# EasyEDA Pro project Remote323Board.eprj

# Schematic remote_3-2-3
Board Name: remote_3-2-3; Create Date: 2026-04-01; Page Name: remote_3-2-3; Project Name: Remote323Board; Schematic Name: remote_3-2-3; Update Date: 2026-03-31; Date: 4/1/2026; File: remote_3-2-3; Id: /; Rev: 1.0; Sheet: /; Title: Remote323Board
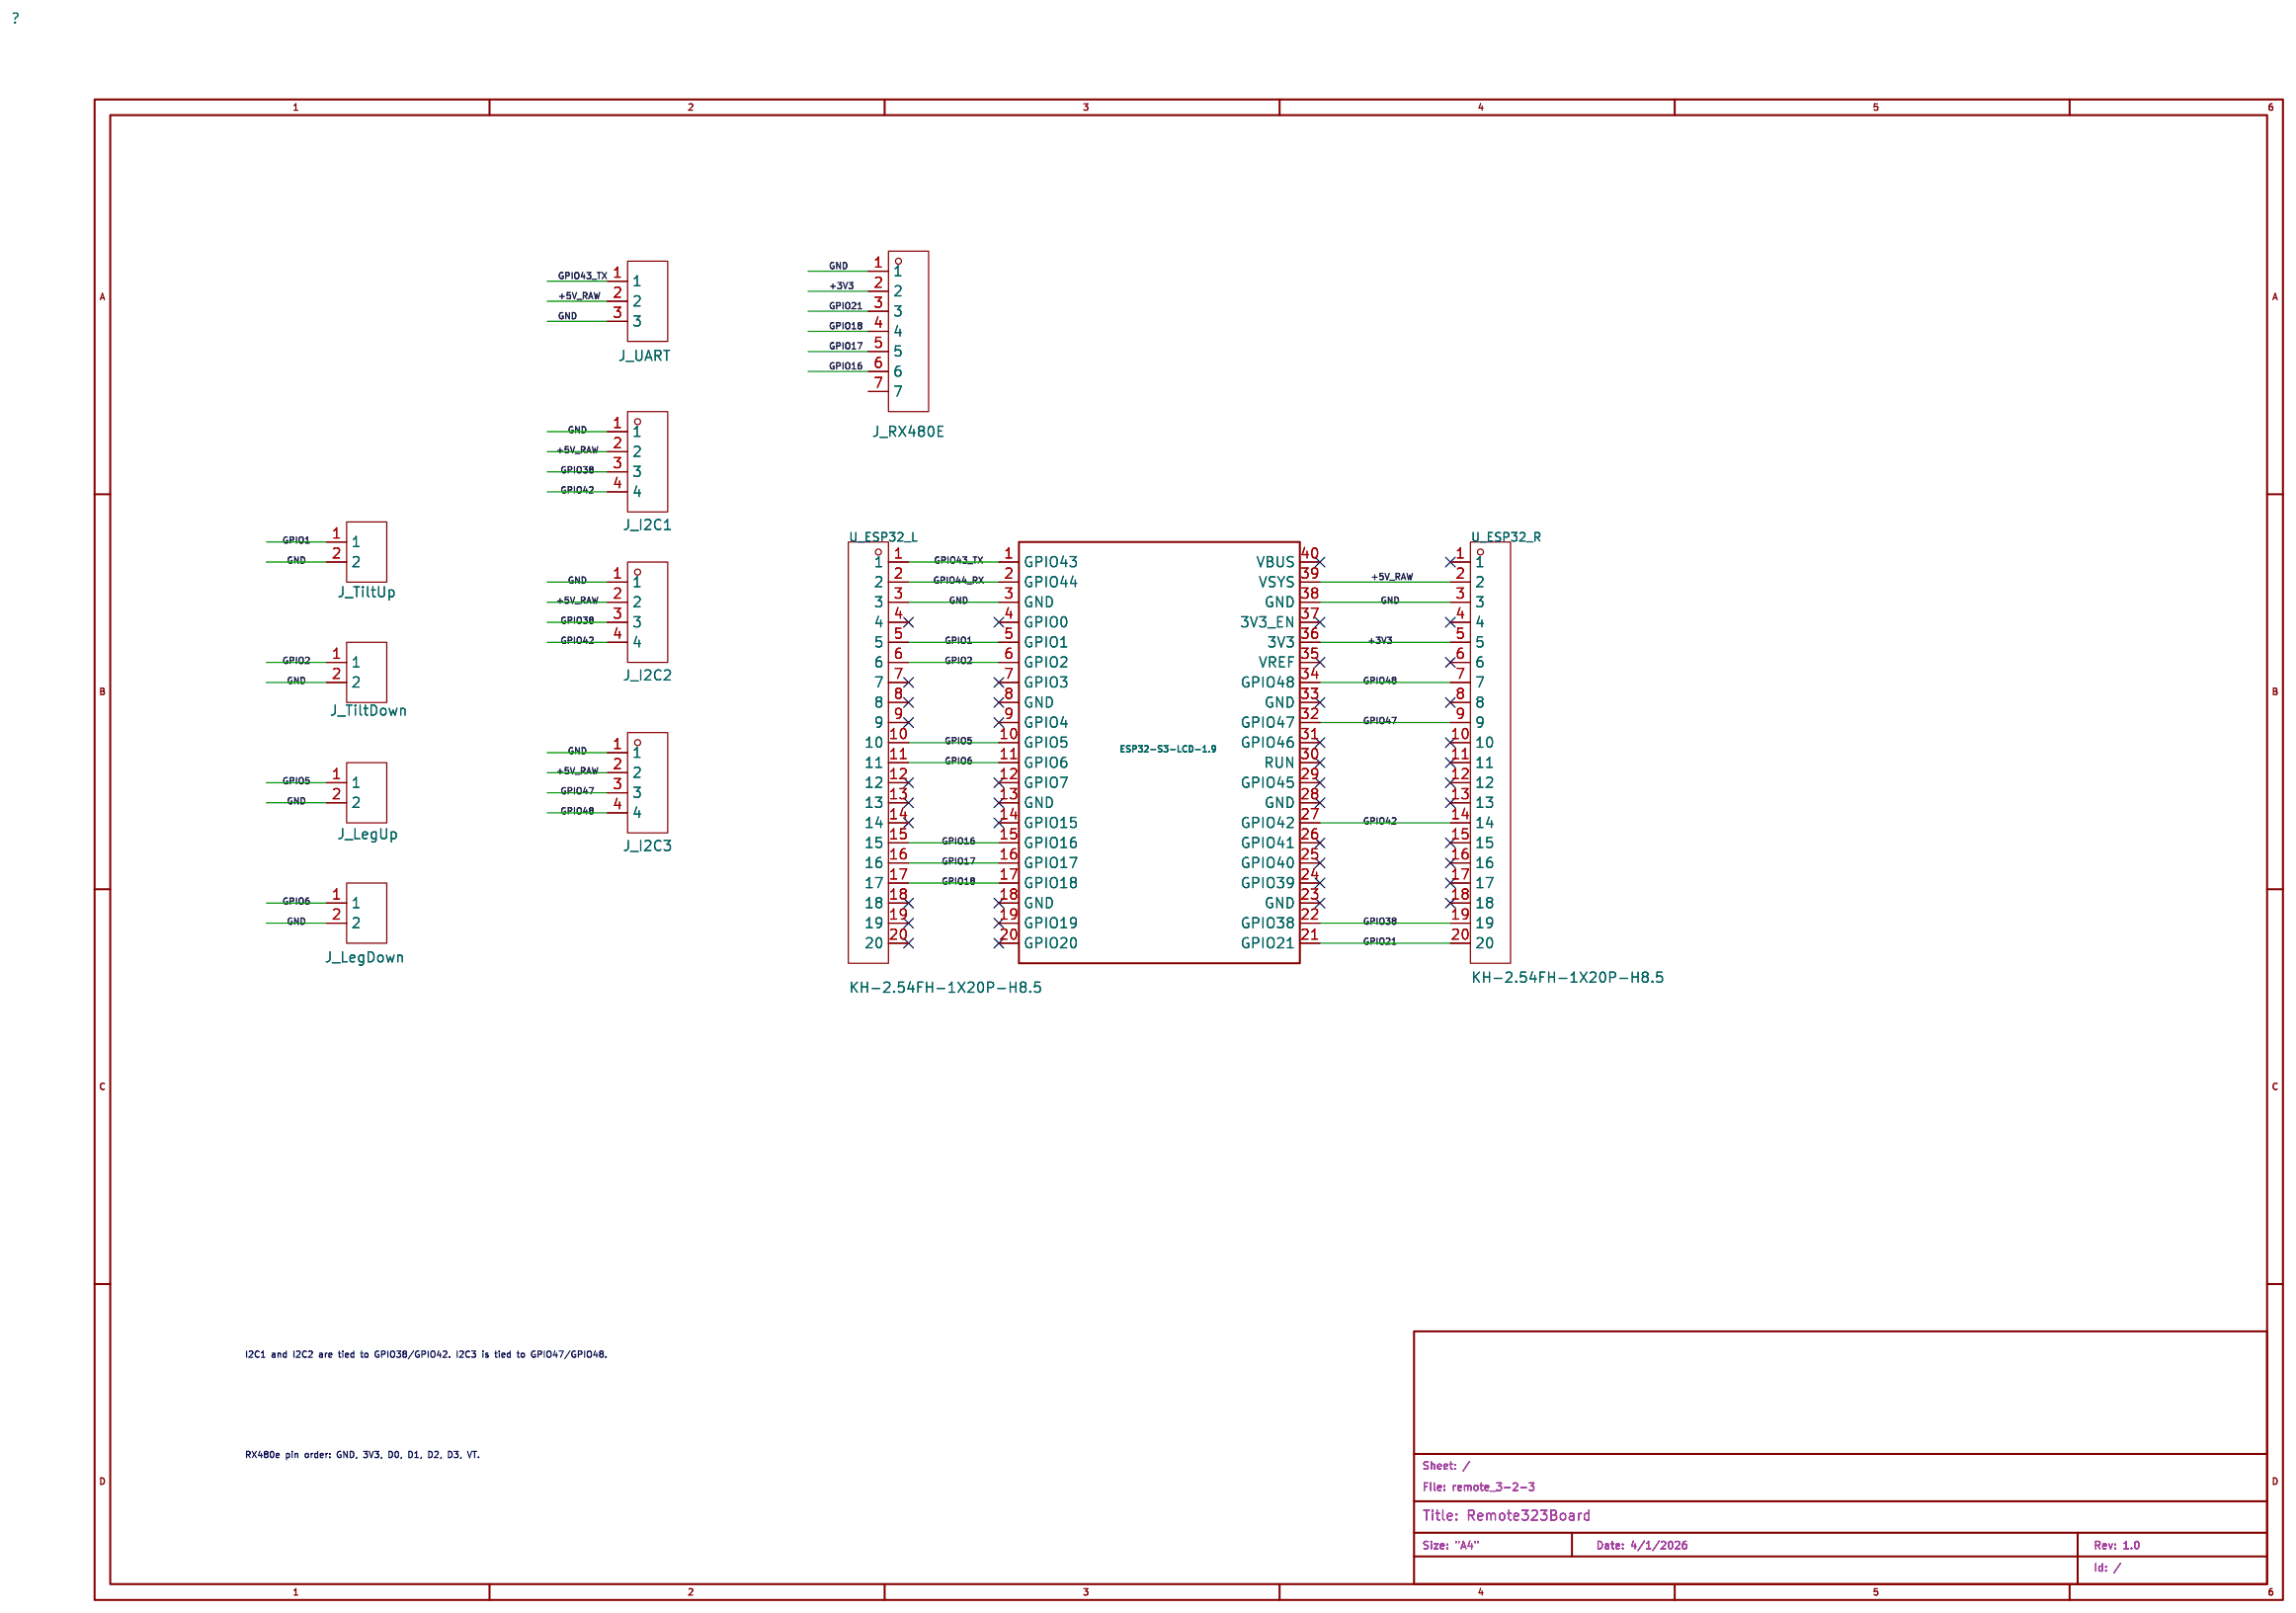
[diagram p0: schematic sheet]

## Parts
J_I2C1  PZ254V-11-04P  [HDR-TH_4P-P2.54-V-M]
J_I2C2  PZ254V-11-04P  [HDR-TH_4P-P2.54-V-M]
J_I2C3  PZ254V-11-04P  [HDR-TH_4P-P2.54-V-M]
J_LegDown  PZ254V-11-02P  [HDR-TH_2P-P2.54-V-M]
J_LegUp  PZ254V-11-02P  [HDR-TH_2P-P2.54-V-M]
J_RX480E  HC-PM254-5.0H-1x7PZ  [HDR-TH_7P-P2.54-V-M-3]
J_TiltDown  PZ254V-11-02P  [HDR-TH_2P-P2.54-V-M]
J_TiltUp  PZ254V-11-02P  [HDR-TH_2P-P2.54-V-M]
J_UART  PZ254V-11-03P  [HDR-TH_3P-P2.54-V-M_PZ254V-11-03P]
U1  ESP32-S3-LCD-1.9  (no BOM)
U_ESP32_L  KH-2.54FH-1X20P-H8.5  [HDR-TH_20P-P2.54-V-F-2]
U_ESP32_R  KH-2.54FH-1X20P-H8.5  [HDR-TH_20P-P2.54-V-F-2]

## Library data of the parts
J_I2C1-J_I2C3 = PZ254V-11-04P: Pin Structure:1x4P Pitch:2.54mm Row Spacing:- Circluar Pins/Square Pins:Pin Header Mounting Type:Through Hole Number of Rows:1 Number of Pins:4P Current Rating:3A Voltage Rating (Max):250V Length of Mating Pin:6mm Insulation Height:2.5mm Length of End Con; LCSC Part Name: 1x4P 间距:2.54mm 方针 直插; Supplier Part: C2691448; Manufacturer: XFCN(兴飞); Supplier Footprint: 插件,P=2.54mm; JLCPCB Part Class: Extended Part; Datasheet: https://item.szlcsc.com/datasheet/PZ254V-11-04P/2801085.html; Supplier: LCSC; Pin Structure: 1x4P; Pitch: 2.54mm; Circluar Pins/Square Pins: Pin Header; Mounting Type: Through Hole; Number of Rows: 1; Number of Pins: 4P; Current Rating: 3A; Voltage Rating (Max): 250V; Length of Mating Pin: 6mm; Insulation Height: 2.5mm; Length of End Connection Pin: 3mm; Operating Temperature: -40℃~+105℃; Color: Black
J_LegDown J_LegUp J_TiltDown J_TiltUp = PZ254V-11-02P: Pin Structure:1x2P Pitch:2.54mm Row Spacing:- Circluar Pins/Square Pins:Pin Header Mounting Type:Through Hole Number of Rows:1 Number of Pins:2P Current Rating:3A Voltage Rating (Max):250V Length of Mating Pin:6mm Insulation Height:2.5mm Length of End Con; LCSC Part Name: 1x2P 间距:2.54mm 方针 直插; Supplier Part: C492401; Manufacturer: XFCN(兴飞); Supplier Footprint: 插件,P=2.54mm; JLCPCB Part Class: Extended Part; Datasheet: https://item.szlcsc.com/datasheet/PZ254V-11-02P/502957.html; Supplier: LCSC; Pin Structure: 1x2P; Pitch: 2.54mm; Circluar Pins/Square Pins: Pin Header; Mounting Type: Through Hole; Number of Rows: 1; Number of Pins: 2P; Current Rating: 3A; Voltage Rating (Max): 250V; Length of Mating Pin: 6mm; Insulation Height: 2.5mm; Length of End Connection Pin: 3mm; Contact Material: Brass; Operating Temperature: -40℃~+105℃; Color: Black
J_RX480E = HC-PM254-5.0H-1x7PZ: Holes Structure:1x7P Pitch:2.54mm Row Spacing:- Circular Hole / Square Hole:Square Hole Mounting Type:Through Hole Number of Rows:1 Number of Positions:7P Current Rating:3A Voltage Rating (Max):- Holes Direction:Top Insulation Height:5mm Contact Material:; LCSC Part Name: 间距2.54mm 1x7Pin 直插 PC3.0 H5.0; Supplier Part: C27985232; Manufacturer: HC(虹成电子); Supplier Footprint: 插件,P=2.54mm; JLCPCB Part Class: Extended Part; Datasheet: https://item.szlcsc.com/datasheet/HC-PM254-5.0H-1x7PZ/29721190.html; Supplier: LCSC; Holes Structure: 1x7P; Pitch: 2.54mm; Circular Hole / Square Hole: Square Hole; Mounting Type: Through Hole; Number of Rows: 1; Number of Positions: 7P; Current Rating: 3A; Holes Direction: Top; Insulation Height: 5mm; Contact Material: Brass; Contact Plating: Gold; Operating Temperature: -40℃~+105℃; PIN Length: 3mm
J_UART = PZ254V-11-03P: LCSC Part Name: 1x3P 间距:2.54mm 方针 直插; Supplier Part: C2937625; Manufacturer: XFCN(兴飞); Supplier Footprint: 插件,P=2.54mm; JLCPCB Part Class: Extended Part; Datasheet: https://item.szlcsc.com/datasheet/PZ254V-11-03P/3293280.html; Supplier: LCSC; Pin Structure: 1x3P; Pitch: 2.54mm; Circluar Pins/Square Pins: Pin Header; Mounting Type: Through Hole; Number of Rows: 1; Number of Pins: 3P; Current Rating: 3A; Voltage Rating (Max): 250V; Length of Mating Pin: 6mm; Insulation Height: 2.5mm; Length of End Connection Pin: 3mm; Operating Temperature: -40℃~+105℃; Color: Black
U1 = Remote323_Waveshare_ESP32_S3_LCD_1_9
U_ESP32_L U_ESP32_R = KH-2.54FH-1X20P-H8.5: LCSC Part Name: 间距:2.54mm 1x20P 直插; Supplier Part: C2905423; Manufacturer: kinghelm(金航标); Supplier Footprint: 插件,P=2.54mm; JLCPCB Part Class: Extended Part; Datasheet: https://item.szlcsc.com/datasheet/KH-2.54FH-1X20P-H8.5/3175197.html; Supplier: LCSC; Holes Structure: 1x20P; Pitch: 2.54mm; Circular Hole / Square Hole: Square Hole; Mounting Type: Through Hole; Number of Rows: 1; Number of Positions: 20P; Current Rating: 3A; Holes Direction: Top; Insulation Height: 8.5mm; Operating Temperature: -40℃~+105℃

## Nets
+3V3: J_RX480E.2 U1.36(3V3) U_ESP32_R.5
+5V_RAW: J_I2C1.2 J_I2C2.2 J_I2C3.2 J_UART.2 U1.39(VSYS) U_ESP32_R.2
GND: J_I2C1.1 J_I2C2.1 J_I2C3.1 J_LegDown.2 J_LegUp.2 J_RX480E.1 J_TiltDown.2 J_TiltUp.2 J_UART.3 U1.3(GND) U1.38(GND) U_ESP32_L.3 U_ESP32_R.3
GPIO1: J_TiltUp.1 U1.5(GPIO1) U_ESP32_L.5
GPIO2: J_TiltDown.1 U1.6(GPIO2) U_ESP32_L.6
GPIO5: J_LegUp.1 U1.10(GPIO5) U_ESP32_L.10
GPIO6: J_LegDown.1 U1.11(GPIO6) U_ESP32_L.11
GPIO16: J_RX480E.6 U1.15(GPIO16) U_ESP32_L.15
GPIO17: J_RX480E.5 U1.16(GPIO17) U_ESP32_L.16
GPIO18: J_RX480E.4 U1.17(GPIO18) U_ESP32_L.17
GPIO21: J_RX480E.3 U1.21(GPIO21) U_ESP32_R.20
GPIO38: J_I2C1.3 J_I2C2.3 U1.22(GPIO38) U_ESP32_R.19
GPIO42: J_I2C1.4 J_I2C2.4 U1.27(GPIO42) U_ESP32_R.14
GPIO43_TX: J_UART.1 U1.1(GPIO43) U_ESP32_L.1
GPIO44_RX: U1.2(GPIO44) U_ESP32_L.2
GPIO47: J_I2C3.3 U1.32(GPIO47) U_ESP32_R.9
GPIO48: J_I2C3.4 U1.34(GPIO48) U_ESP32_R.7

Not connected (* = marked no-connect by the designer): J_RX480E 7; U1 4(GPIO0)* 7(GPIO3)* 8(GND)* 9(GPIO4)* 12(GPIO7)* 13(GND)* 14(GPIO15)* 18(GND)* 19(GPIO19)* 20(GPIO20)* 23(GND)* 24(GPIO39)* 25(GPIO40)* 26(GPIO41)* 28(GND)* 29(GPIO45)* 30(RUN)* 31(GPIO46)* 33(GND)* 35(VREF)* 37(3V3_EN)* 40(VBUS)*; U_ESP32_L 4* 7* 8* 9* 12* 13* 14* 18* 19* 20*; U_ESP32_R 1* 4* 6* 8* 10* 11* 12* 13* 15* 16* 17* 18*

## Notes on the sheet
- I2C1 and I2C2 are tied to GPIO38/GPIO42. I2C3 is tied to GPIO47/GPIO48.
- RX480e pin order: GND, 3V3, D0, D1, D2, D3, VT.

# Board remote_3-2-3
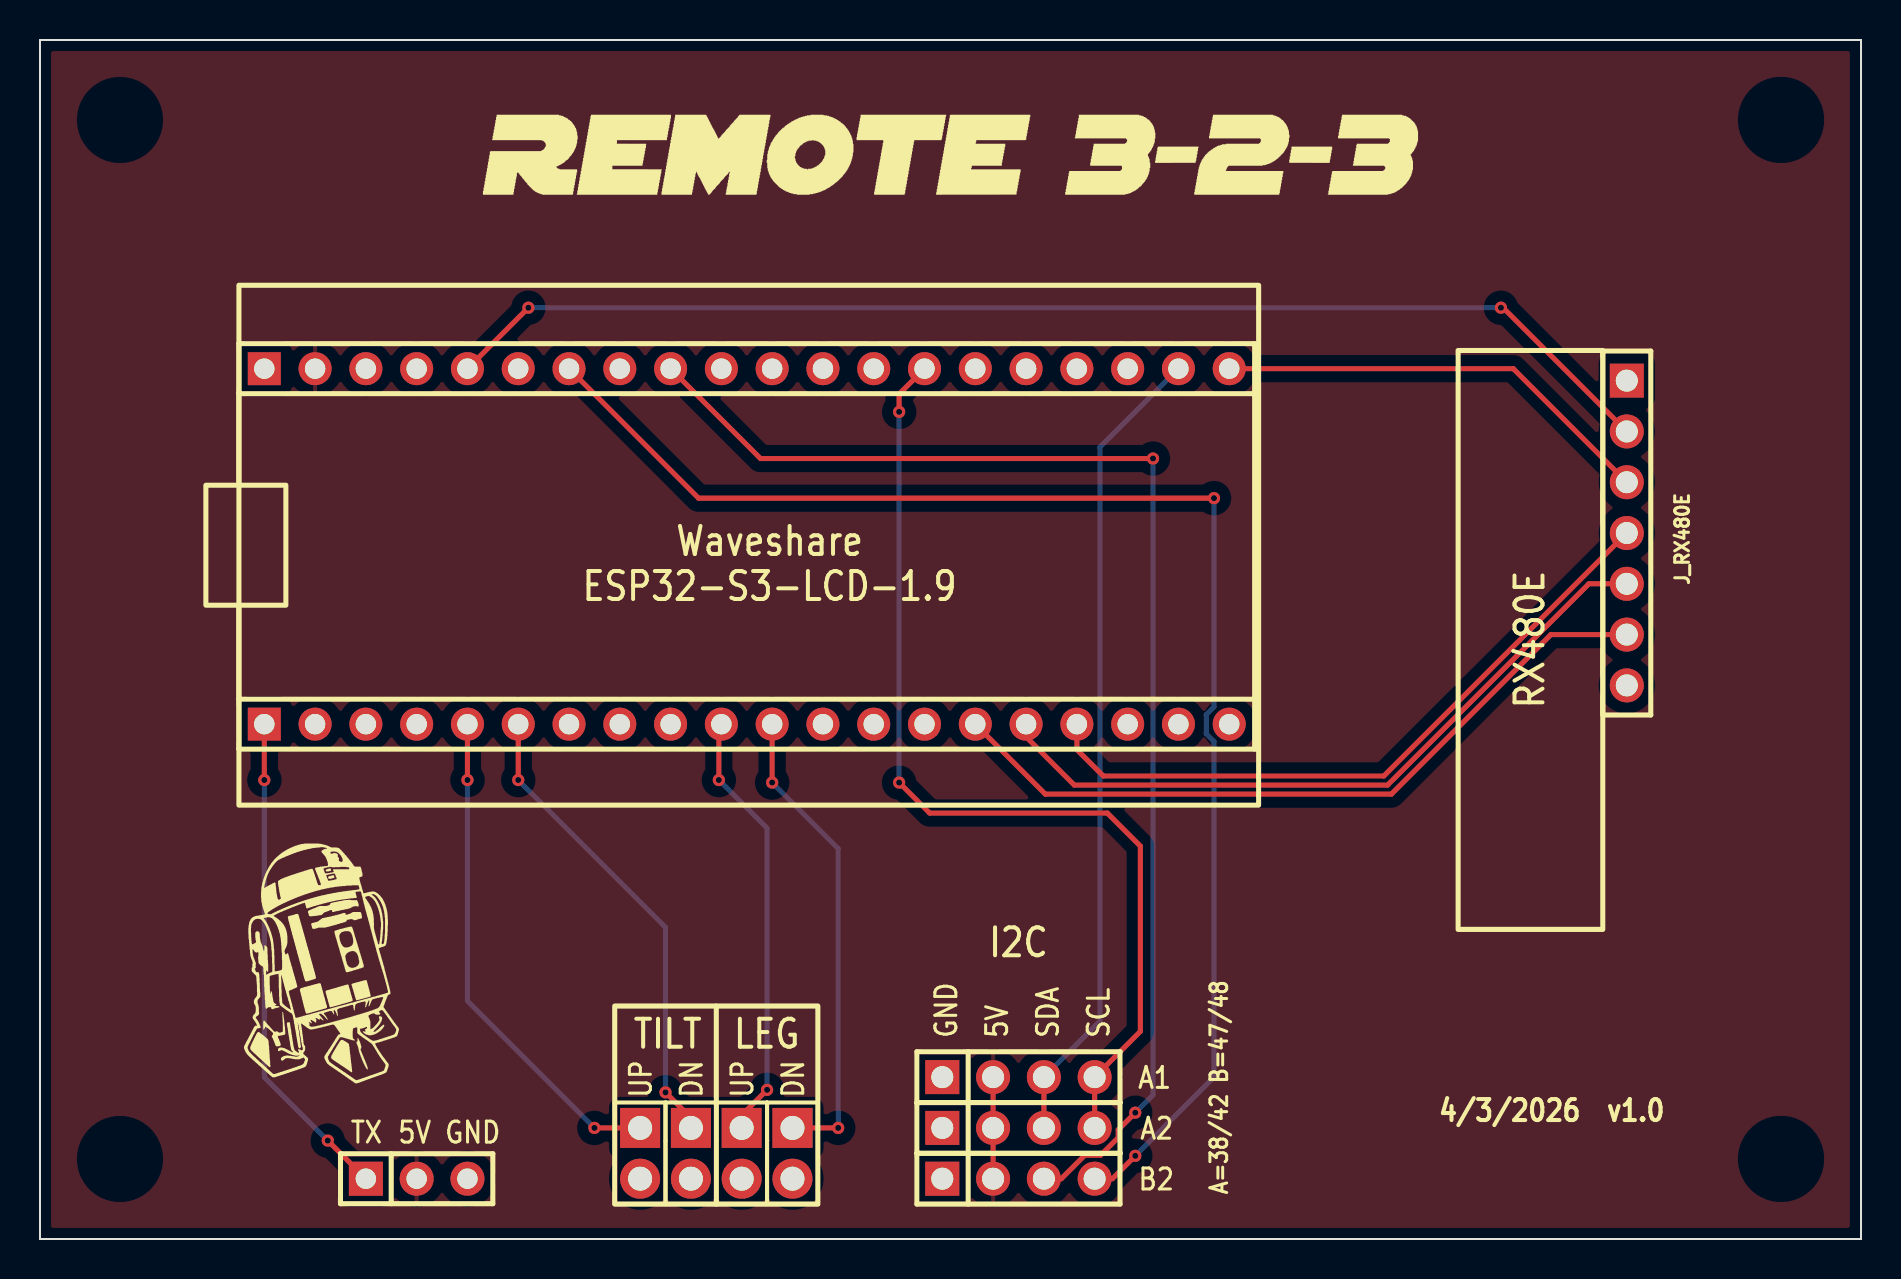
[diagram p1: board, top side]
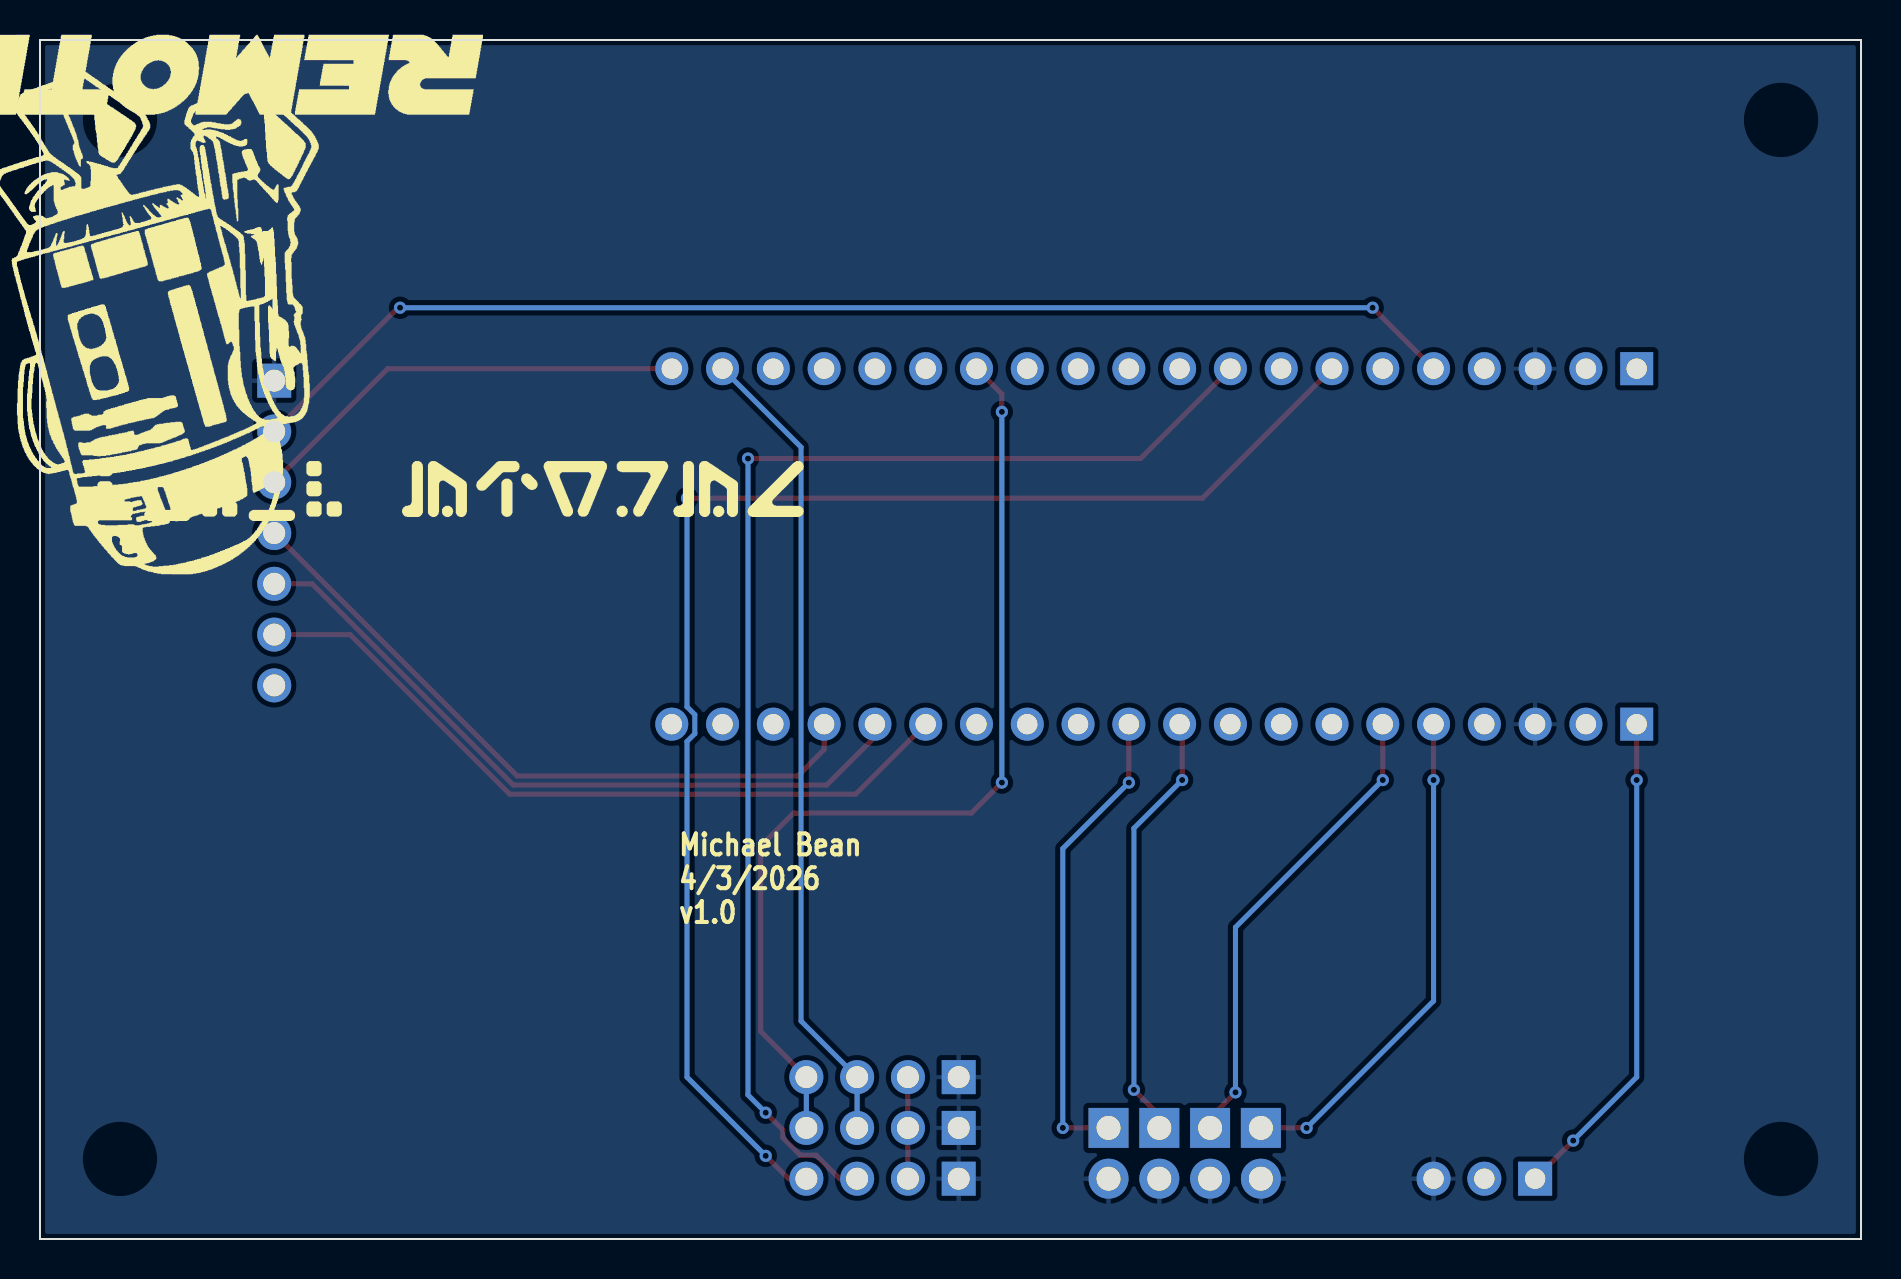
[diagram p2: board, bottom side, seen from below]

Outline 91.08 x 59.97 mm; copper layers: Top Layer, Bottom Layer. Coordinates in mm from the lower left corner of the outline.
Outline path: 0,59.97 91.08,59.97 91.08,0 0,0 0,59.97
Stack: Top Layer 0.035mm / Dielectric1 1.51mm FR4 er 4.5 / Bottom Layer 0.035mm

## Design rules (mm)
spacing safeClearance (default): track to track 0.2, other pairs 0.2 to 0.25
track width trackWidth (default): min 0.127, default 0.254, max 2.54
differential pair differentialPair (default): width min 0.127, default 0.254, max 2.54; gap min 0.152, default 0.152
via viaSize (default): diameter min 0.5, default 0.61, max 10; hole min 0.3, default 0.305, max 6

## Placement (name value [footprint] x y rotation side)
J_I2C1  PZ254V-11-04P  [HDR-TH_4P-P2.54-V-M]  48.94 8.1 0 top
J_I2C2  PZ254V-11-04P  [HDR-TH_4P-P2.54-V-M]  48.94 5.56 0 top
J_I2C3  PZ254V-11-04P  [HDR-TH_4P-P2.54-V-M]  48.94 3.02 0 top
J_LegDown  PZ254V-11-02P  [HDR-TH_2P-P2.54-V-M]  37.63 4.29 270 top
J_LegUp  PZ254V-11-02P  [HDR-TH_2P-P2.54-V-M]  35.09 4.29 270 top
J_RX480E  HC-PM254-5.0H-1x7PZ  [HDR-TH_7P-P2.54-V-M-3]  79.36 35.31 270 top
J_TiltDown  PZ254V-11-02P  [HDR-TH_2P-P2.54-V-M]  32.56 4.29 270 top
J_TiltUp  PZ254V-11-02P  [HDR-TH_2P-P2.54-V-M]  30.01 4.29 270 top
J_UART  PZ254V-11-03P  [HDR-TH_3P-P2.54-V-M_PZ254V-11-03P]  18.84 3.02 0 top
U_ESP32_L  KH-2.54FH-1X20P-H8.5  [HDR-TH_20P-P2.54-V-F-2]  35.35 25.75 0 top
U_ESP32_R  KH-2.54FH-1X20P-H8.5  [HDR-TH_20P-P2.54-V-F-2]  35.35 43.53 0 top

## Footprints (pads in the part's own frame, mm; a bottom-side part is the same pattern mirrored in y, then rotated)
HDR-TH_2P-P2.54-V-M
  rect 2x2 hole 1.2: 1(-1.27,0)
  round 2 hole 1.2: 2(1.27,0)
HDR-TH_3P-P2.54-V-M_PZ254V-11-03P
  rect 1.7x1.7 hole 1.02: 1(-2.54,0)
  round 1.7 hole 1.02: 2(0,0) 3(2.54,0)
HDR-TH_4P-P2.54-V-M
  rect 1.7x1.7 hole 1.1: 1(-3.81,0)
  round 1.7 hole 1.1: 2(-1.27,0) 3(1.27,0) 4(3.81,0)
HDR-TH_7P-P2.54-V-M-3
  rect 1.7x1.7 hole 1.1: 1(-7.62,0)
  round 1.7 hole 1.1: 2(-5.08,0) 3(-2.54,0) 4(0,0) 5(2.54,0) 6(5.08,0) 7(7.62,0)
HDR-TH_20P-P2.54-V-F-2
  rect 1.65x1.65 hole 1.02: 1(-24.13,0)
  round 1.65 hole 1.02: 2(-21.59,0) 3(-19.05,0) 4(-16.51,0) 5(-13.97,0) 6(-11.43,0) 7(-8.89,0) 8(-6.35,0) 9(-3.81,0) 10(-1.27,0) 11(1.27,0) 12(3.81,0) 13(6.35,0) 14(8.89,0) 15(11.43,0) 16(13.97,0) 17(16.51,0) 18(19.05,0) 19(21.59,0) 20(24.13,0)

## Nets
As in the schematic.

Pads without a net: J_RX480E 7; U_ESP32_L 4 7 8 9 12 13 14 18 19 20; U_ESP32_R 1 4 6 8 10 11 12 13 15 16 17 18

## Via types
v1: diameter 0.61, hole 0.305, Top Layer to Bottom Layer, 18 vias

## Routing (per net, layer and track width the routed paths; a pad name or vN(x,y) marks a point on that pad's centre or on a via; arc(x,y) is an arc through that point)
+3V3: length 61.8
  Top Layer w0.254: J_RX480E.2 73.17,46.58 v1(73.07,46.58) ; 21.38,43.53 v1(24.43,46.58)
  Bottom Layer w0.254: v1(24.43,46.58) v1(73.07,46.58)
+5V_RAW: length 5.1
  Top Layer w0.254: J_I2C3.2 J_I2C2.2 J_I2C1.2
GPIO1: length 25.1
  Top Layer w0.254: 21.38,25.75 v1(21.38,22.96) ; v1(27.73,5.56) J_TiltUp.1
  Bottom Layer w0.254: v1(21.38,22.96) 21.38,11.91 v1(27.73,5.56)
GPIO2: length 23.8
  Top Layer w0.254: v1(31.28,7.33) 32.56,6.06 J_TiltDown.1 ; 23.92,25.75 v1(23.92,22.96)
  Bottom Layer w0.254: v1(31.28,7.33) 31.28,15.59 v1(23.92,22.96)
GPIO5: length 21.8
  Top Layer w0.254: J_LegUp.1 35.09,6.19 v1(36.37,7.46) ; v1(33.95,22.96) 33.95,25.62 34.08,25.75
  Bottom Layer w0.254: v1(33.95,22.96) 36.37,20.54 v1(36.37,7.46)
GPIO6: length 23.8
  Top Layer w0.254: U_ESP32_L.11 v1(36.62,22.83) ; v1(39.92,5.56) J_LegDown.1
  Bottom Layer w0.254: v1(36.62,22.83) 39.92,19.53 v1(39.92,5.56)
GPIO16: length 37.3
  Top Layer w0.254: J_RX480E.6 75.57,30.23 67.59,22.25 50.28,22.25 U_ESP32_L.15
GPIO17: length 35.8
  Top Layer w0.254: U_ESP32_L.16 49.32,25.11 51.73,22.7 67.4,22.7 77.46,32.77 J_RX480E.5
GPIO18: length 34.4
  Top Layer w0.254: 51.86,25.75 51.86,24.48 53.18,23.16 67.21,23.16 J_RX480E.4
GPIO21: length 22.2
  Top Layer w0.254: J_RX480E.3 73.68,43.53 59.48,43.53
GPIO38: length 43.3
  Top Layer w0.254: J_I2C1.3 J_I2C2.3
  Bottom Layer w0.254: U_ESP32_R.19 53.01,39.6 53.01,10.9 J_I2C1.3 J_I2C2.3
GPIO42: length 52.2
  Top Layer w0.254: J_I2C2.4 J_I2C1.4 55.03,10.38 55.03,19.65 53.38,21.3 44.49,21.3 v1(42.97,22.83) ; 44.24,43.53 42.97,42.26 v1(42.97,41.37)
  Bottom Layer w0.254: v1(42.97,41.37) v1(42.97,22.83) ; J_I2C1.4 J_I2C2.4
GPIO43_TX: length 24.8
  Top Layer w0.254: v1(14.39,4.92) 16.3,3.02 ; U_ESP32_L.1 v1(11.22,22.96)
  Bottom Layer w0.254: v1(11.22,22.96) 11.22,8.1 v1(14.39,4.92)
GPIO47: length 65.2
  Top Layer w0.254: U_ESP32_R.9 36.03,39.03 v1(55.67,39.03) ; v1(54.78,6.32) 53.93,5.46 53.93,5.07 53.05,4.19 52.26,4.19 51.08,3.02 J_I2C3.3
  Bottom Layer w0.254: v1(55.67,39.03) 55.67,39.03 55.67,7.21 v1(54.78,6.32)
GPIO48: length 72.3
  Top Layer w0.254: 26.46,43.53 32.94,37.05 v1(58.72,37.05) ; v1(54.78,4.16) 53.64,3.02 J_I2C3.4
  Bottom Layer w0.254: v1(58.72,37.05) 58.72,26.62 58.33,26.23 58.33,25.27 58.72,24.88 58.72,8.1 v1(54.78,4.16)

## Copper pours and planes (outline as drawn; the poured copper is in the pictures)
+5V_RAW on Top Layer: 0.2,59.77 109.8,59.77 109.8,-9.83 0.2,-9.83
GND on Bottom Layer: 0.2,59.77 109.8,59.77 109.8,-9.83 0.2,-9.83
GND on Bottom Layer: 0.2,59.77 109.8,59.77 109.8,-9.83 0.2,-9.83

## Text on the board
Bottom Silkscreen Layer: Michael Bean / 4/3/2026 / v1.0
Top Silkscreen Layer: A=38/42 B=47/48 | TX | 5V | GND | A1 | B2 | A2 | SDA | SCL | UP | DN | 4/3/2026  v1.0 | TILT | LEG | Waveshare / ESP32-S3-LCD-1.9 | I2C | RX480E
